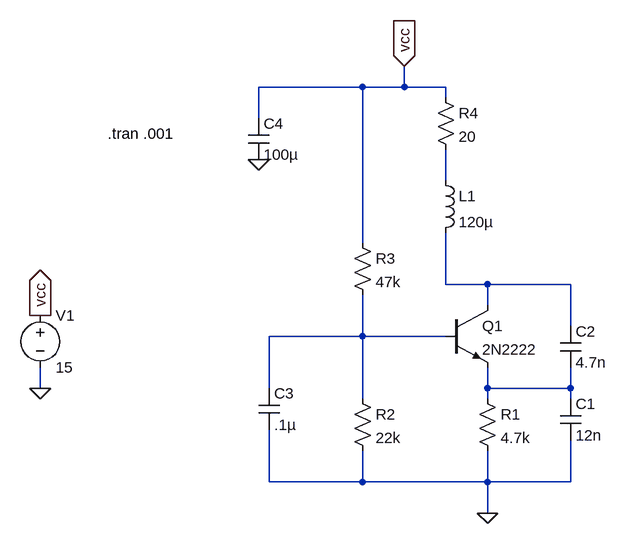
[diagram p0: schematic Colpitts_Corrigido.asc]
Colpitts_Corrigido.asc, the LTspice schematic file:
Version 4
SHEET 1 880 680
WIRE 64 -192 -96 -192
WIRE 128 -192 128 -224
WIRE 128 -192 64 -192
WIRE 192 -192 128 -192
WIRE 192 -176 192 -192
WIRE -96 -144 -96 -192
WIRE 192 -48 192 -96
WIRE 64 48 64 -192
WIRE 192 112 192 32
WIRE 256 112 192 112
WIRE 384 112 256 112
WIRE 256 144 256 112
WIRE 384 176 384 112
WIRE 64 192 64 128
WIRE 64 192 -80 192
WIRE 192 192 64 192
WIRE -432 272 -432 240
WIRE -80 272 -80 192
WIRE 256 272 256 240
WIRE 384 272 384 240
WIRE 384 272 256 272
WIRE 64 288 64 192
WIRE 256 288 256 272
WIRE 384 288 384 272
WIRE -80 416 -80 336
WIRE 64 416 64 368
WIRE 64 416 -80 416
WIRE 256 416 256 368
WIRE 256 416 64 416
WIRE 384 416 384 352
WIRE 384 416 256 416
WIRE 256 464 256 416
FLAG 256 464 0
FLAG -432 160 vcc
IOPIN -432 160 Out
FLAG 128 -224 vcc
IOPIN 128 -224 In
FLAG -432 272 0
FLAG -96 -80 0
SYMBOL npn 192 144 R0
SYMATTR InstName Q1
SYMATTR Value 2N2222
SYMBOL res 240 272 R0
SYMATTR InstName R1
SYMATTR Value 4.7k
SYMBOL res 48 272 R0
SYMATTR InstName R2
SYMATTR Value 22k
SYMBOL res 48 32 R0
SYMATTR InstName R3
SYMATTR Value 47k
SYMBOL ind 176 -64 R0
SYMATTR InstName L1
SYMATTR Value 120µ
SYMBOL cap 368 288 R0
SYMATTR InstName C1
SYMATTR Value 12n
SYMBOL cap 368 176 R0
SYMATTR InstName C2
SYMATTR Value 4.7n
SYMBOL cap -96 272 R0
SYMATTR InstName C3
SYMATTR Value .1µ
SYMBOL voltage -432 144 R0
WINDOW 123 0 0 Left 2
WINDOW 39 0 0 Left 2
SYMATTR InstName V1
SYMATTR Value 15
SYMBOL res 176 -192 R0
SYMATTR InstName R4
SYMATTR Value 20
SYMBOL cap -112 -144 R0
SYMATTR InstName C4
SYMATTR Value 100µ
TEXT -328 -120 Left 2 !.tran .001

The netlist it stands for:
* Colpitts_Corrigido.asc
Q1 N002 N003 N004 0 2N2222
R1 N004 0 4.7k
R2 N003 0 22k
R3 vcc N003 47k
L1 N001 N002 120µ
C1 N004 0 12n
C2 N002 N004 4.7n
C3 N003 0 .1µ
V1 vcc 0 15
R4 vcc N001 20
C4 vcc 0 100µ
.model NPN NPN
.model PNP PNP
.lib standard.bjt
.tran .001
.backanno
.end